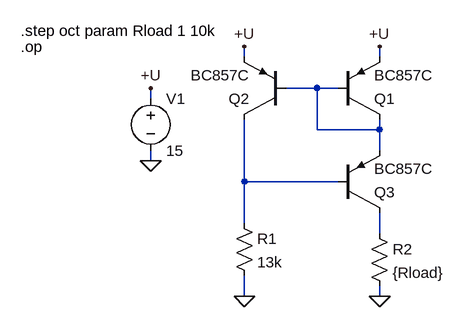
[diagram p0: schematic mirror-wilson.asc]
mirror-wilson.asc, the LTspice schematic file:
Version 4
SHEET 1 880 680
WIRE 192 48 192 32
WIRE 400 48 400 32
WIRE 304 96 256 96
WIRE 336 96 304 96
WIRE 48 112 48 96
WIRE 304 160 304 96
WIRE 400 160 400 144
WIRE 400 160 304 160
WIRE 400 192 400 160
WIRE 48 208 48 192
WIRE 192 240 192 144
WIRE 336 240 192 240
WIRE 192 304 192 240
WIRE 400 320 400 288
WIRE 192 416 192 384
WIRE 400 416 400 400
FLAG 48 208 0
FLAG 48 96 +U
FLAG 192 32 +U
FLAG 400 32 +U
FLAG 400 416 0
FLAG 192 416 0
SYMBOL voltage 48 96 R0
WINDOW 123 0 0 Left 2
WINDOW 39 0 0 Left 2
SYMATTR InstName V1
SYMATTR Value 15
SYMBOL pnp 336 144 M180
SYMATTR InstName Q1
SYMATTR Value BC857C
SYMBOL pnp 256 144 R180
SYMATTR InstName Q2
SYMATTR Value BC857C
SYMBOL res 384 304 R0
SYMATTR InstName R2
SYMATTR Value {Rload}
SYMBOL pnp 336 288 M180
SYMATTR InstName Q3
SYMATTR Value BC857C
SYMBOL res 176 288 R0
SYMATTR InstName R1
SYMATTR Value 13k
TEXT -152 8 Left 2 !.step oct param Rload 1 10k
TEXT -152 32 Left 2 !.op

The netlist it stands for:
* mirror-wilson.asc
V1 +U 0 15
Q1 N001 N001 +U 0 BC857C
Q2 N002 N001 +U 0 BC857C
R2 N003 0 {Rload}
Q3 N003 N002 N001 0 BC857C
R1 N002 0 13k
.model NPN NPN
.model PNP PNP
.lib standard.bjt
.step oct param Rload 1 10k
.op
.backanno
.end